# EAGLE design main (EAGLE 7.6.0)
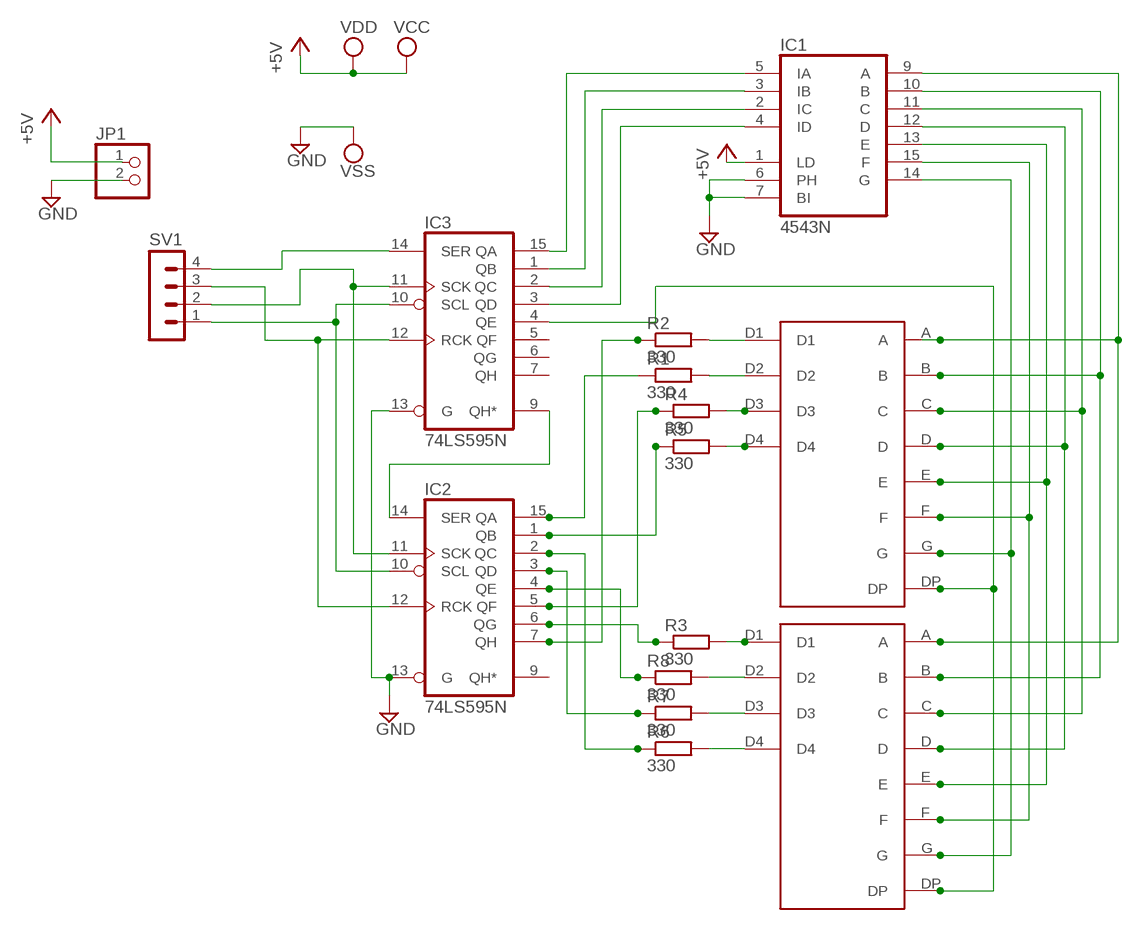
[diagram p0: schematic, sheet 1]

## Parts
IC1  4543N  [DIL16]
IC2  74LS595N  [DIL16]
IC3  74LS595N  [DIL16]
JP1  PINHD-1X2  [1X02]
R1  330  R-EU_0817/22  [P0817/22]
R2  330  R-EU_R0805  [R0805]
R3  330  R-EU_R0805  [R0805]
R4  330  R-EU_R0805  [R0805]
R5  330  R-EU_R0805  [R0805]
R6  330  R-EU_R0805  [R0805]
R7  330  R-EU_R0805  [R0805]
R8  330  R-EU_R0805  [R0805]
SV1  MA04-1  [MA04-1]
U$1  4-DIGIT_7-SEGMENT-DISPLAYTHROUGH-HOLE  [4-DIGIT_7-SEGMENT-DISPLAY]
U$2  4-DIGIT_7-SEGMENT-DISPLAYTHROUGH-HOLE  [4-DIGIT_7-SEGMENT-DISPLAY]

## Nets
+5V: IC1.1(LD) JP1.1 ; supply symbol labelled VDD, VCC
GND: IC1.6(PH) IC1.7(BI) IC2.13(G) IC3.13(G) JP1.2 ; supply symbol labelled VSS
N$1: IC1.9(A) U$1.A U$2.A
N$2: IC1.10(B) U$1.B U$2.B
N$3: IC1.11(C) U$1.C U$2.C
N$4: IC1.12(D) U$1.D U$2.D
N$5: IC1.13(E) U$1.E U$2.E
N$6: IC1.15(F) U$1.F U$2.F
N$7: IC1.14(G) U$1.G U$2.G
N$8: IC3.4(QE) U$1.DP U$2.DP
N$9: R2.2 U$1.D1
N$10: R1.2 U$1.D2
N$11: R3.2 U$2.D1
N$12: R5.2 U$1.D4
N$13: R4.2 U$1.D3
N$14: R8.2 U$2.D2
N$15: R7.2 U$2.D3
N$16: R6.2 U$2.D4
N$17: IC2.14(SER) IC3.9(QH*)
N$18: IC2.12(RCK) IC3.12(RCK) SV1.3
N$19: IC2.10(SCL) IC3.10(SCL) SV1.1
N$20: IC2.11(SCK) IC3.11(SCK) SV1.2
N$21: IC2.15(QA) R1.1
N$22: IC2.7(QH) R2.1
N$24: IC2.6(QG) R3.1
N$25: IC2.5(QF) R4.1
N$26: IC2.1(QB) R5.1
N$27: IC2.2(QC) R6.1
N$28: IC2.3(QD) R7.1
N$29: IC2.4(QE) R8.1
N$31: IC3.14(SER) SV1.4
N$33: IC1.5(IA) IC3.15(QA)
N$34: IC1.3(IB) IC3.1(QB)
N$35: IC1.2(IC) IC3.2(QC)
N$36: IC1.4(ID) IC3.3(QD)
Unconnected: IC2.9(QH*) IC3.5(QF) IC3.6(QG) IC3.7(QH)

## Power pins joined to a net without a drawn wire
+5V: IC1.16(VDD) IC2.16(VCC) IC3.16(VCC)
GND: IC1.8(VSS) IC2.8(GND) IC3.8(GND)

## Library data of the parts
IC1 = 45xx:4543: BCD to 7-segment LCD DECODER
IC2 IC3 = 74xx-us:74*595: 8-bit SHIFT REGISTER, output latch
JP1 = pinhead:PINHD-1X2: PIN HEADER
R1-R8 = resistor:R-EU_: RESISTOR, European symbol
SV1 = con-lstb:MA04-1: PIN HEADER; OC_FARNELL: unknown; OC_NEWARK: unknown
U$1 U$2 = 7_segment_lib:4-DIGIT_7-SEGMENT-DISPLAY

## Board
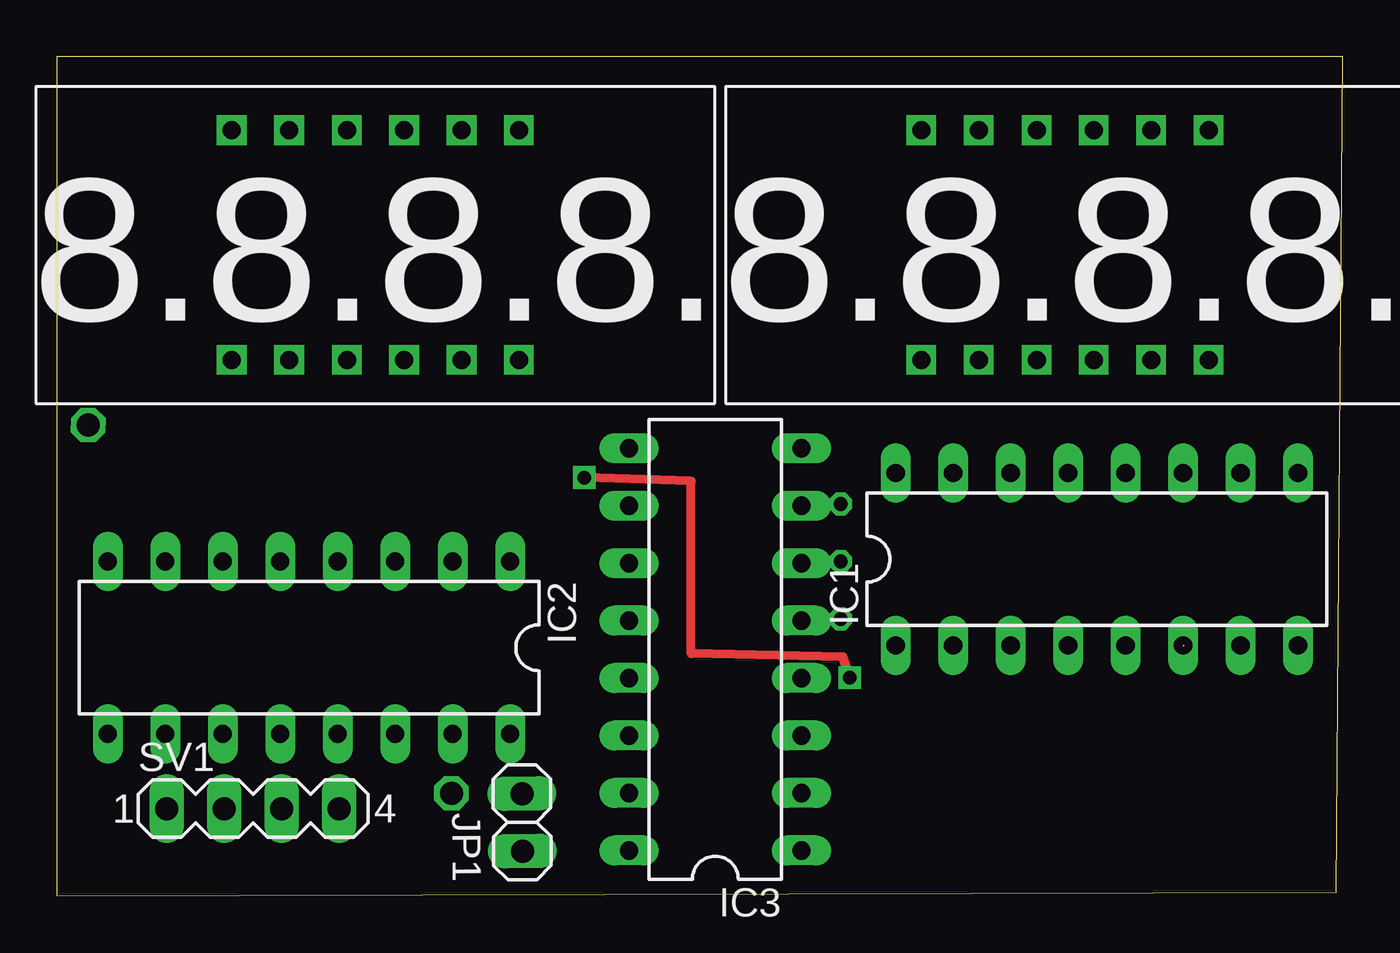
[diagram p1: board, top side]
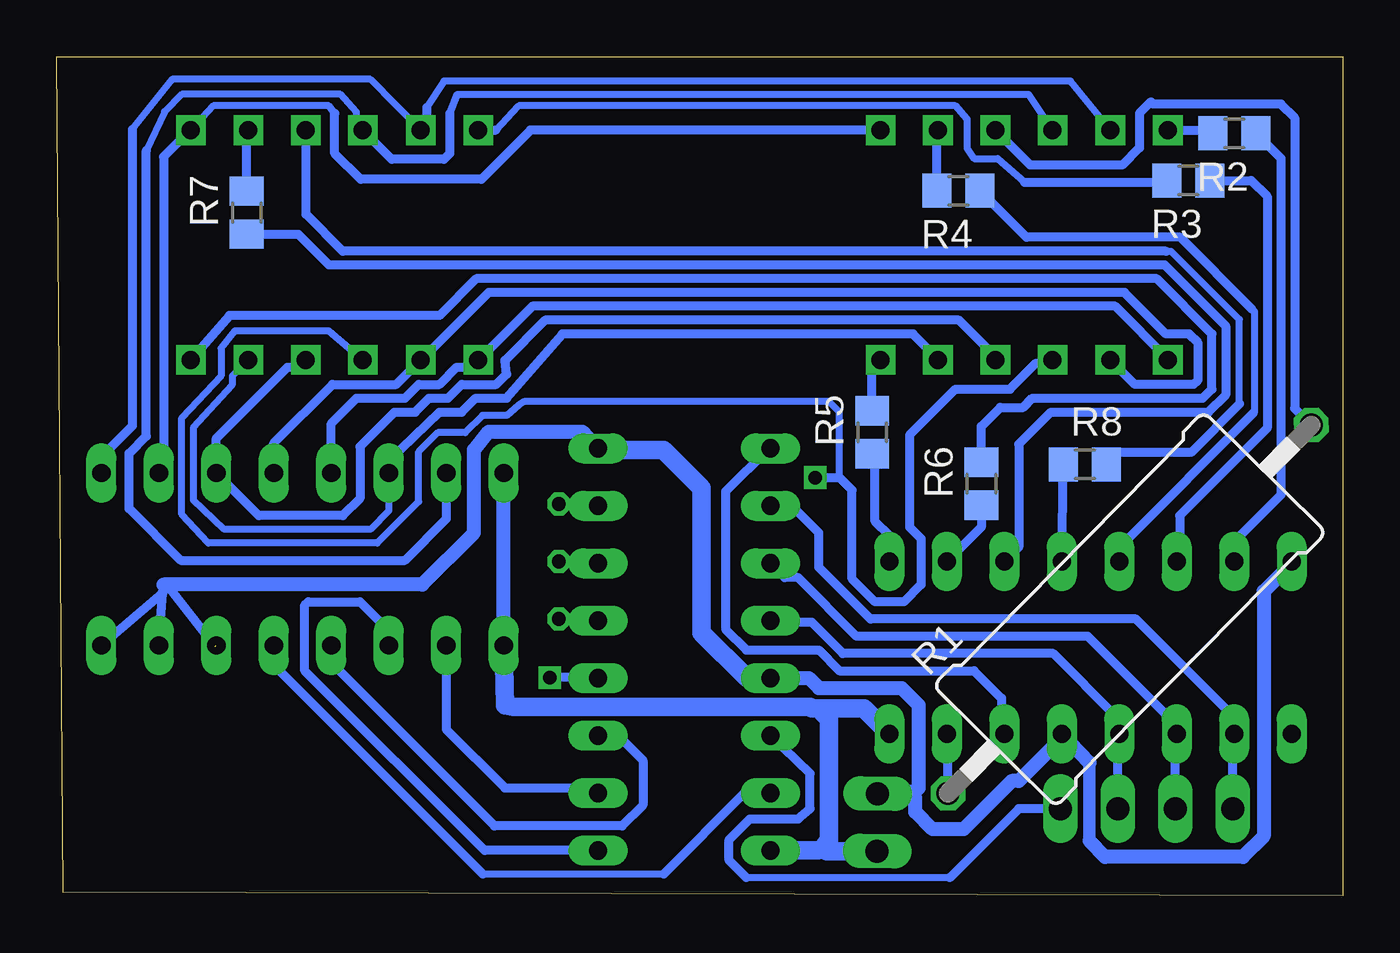
[diagram p2: board, bottom side, seen from below]

Size 56.85 x 37.1 mm. Coordinates in mm from the lower left corner, seen from the top.
Outline: 0,0 56.54,0.15 56.84,37.1 0,37.1 0,0
Copper layers (1*16): Top 0.035mm / dielectric 1.5mm / Bottom 0.035mm
Design rules "default": minimum track width 10mil, minimum drill 24mil, track to track 8mil, track to pad 8mil, pad to pad 8mil, via to via 8mil, smd to smd 8mil, copper to edge 40mil, drill to drill 8mil, minimum pad ring 10mil, minimum via ring 8mil, stop-mask expansion 4mil, vias tented up to drill 0mil, thermal gap 10mil

### Footprints (pad centres in the part's own frame; a part is rotated, then mirrored left to right if it is on the bottom)
DIL16 = drill 0.813 long: 1 -8.89,-3.81; 2 -6.35,-3.81; 3 -3.81,-3.81; 4 -1.27,-3.81; 5 1.27,-3.81; 6 3.81,-3.81; 7 6.35,-3.81; 8 8.89,-3.81; 9 8.89,3.81; 10 6.35,3.81; 11 3.81,3.81; 12 1.27,3.81; 13 -1.27,3.81; 14 -3.81,3.81; 15 -6.35,3.81; 16 -8.89,3.81
1X02 = drill 1.016 long: 1 -1.27,0; 2 1.27,0
P0817/22 = drill 1.016 octagon: 1 -11.43,0; 2 11.43,0
R0805 = smd 1.3 x 1.5: 1 -0.95,0; 2 0.95,0
MA04-1 = drill 1.016 long: 1 -3.81,0; 2 -1.27,0; 3 1.27,0; 4 3.81,0
4-DIGIT_7-SEGMENT-DISPLAY = drill 0.8 square: A 11.19,12.08; B 21.35,12.08; C 16.27,1.92; D 11.19,1.92; D1 8.65,12.08; D2 16.27,12.08; D3 18.81,12.08; D4 21.35,1.92; DP 13.75,1.92; E 8.65,1.92; F 13.75,12.08; G 18.81,1.92

### Placement (x,y rotation side)
IC1  45.97,14.88 0 top
IC2  11.15,10.97 180 top
IC3  29.11,10.9 90 top
JP1  20.57,3.25 90.4 top
R1  9.42,12.67 45.4 bottom
R2  4.8,33.71 180 bottom
R3  6.83,31.62 180 bottom
R4  16.99,31.17 180 bottom
R5  20.8,20.5 90 bottom
R6  15.98,18.21 90 bottom
R7  48.44,30.2 90 bottom
R8  11.4,19.08 0 bottom
SV1  8.69,3.86 0 top
U$1  -0.91,21.77 0 top
U$2  29.57,21.77 0 top

### Tracks (layer width: path | path; a pad name or v marks a point on that pad's centre or on a via)
+5V
  Bottom 0.61: IC1.1 IC1.16
  Bottom 0.813: 22.86,8.28 21.16,8.28 IC2.16 | IC1.1 37.03,8.43 36.65,8.36 23.55,8.36 23.47,8.28 22.86,8.28 | 25.88,2.01 IC3.16 23.19,2.01 23.16,2.03 22.86,2.03 | 22.86,8.28 23.01,8.13 22.71,7.82 22.71,2.44 22.86,2.29 22.86,2.03 | JP1.1 22.81,1.98 22.86,2.03
GND  (1 unrouted)
  Bottom 0.406: 49.84,11.02 51.97,13.77 | IC1.7 52.15,13.39 | 52.15,13.39 52.12,13.77 | IC1.8 52.15,13.39
  Bottom 0.559: 11.2,5.89 11.2,2.44
  Bottom 0.61: 52.12,13.77 51.97,13.77 40.69,13.77 38.41,16.05 38.41,19.71 37.74,20.52 33.6,20.52 IC3.8 | 26.19,9.63 IC3.13 23.6,9.63 23.16,9.19 19.51,9.19 18.75,8.43 18.75,4.77 19.05,4.47 18.9,4.32 18.9,3.71 18.14,2.95 16.76,2.95 14.63,5.08 14.33,5.08 12.42,6.98 IC2.13 | IC2.8 2.26,14.71 3.5,13.46 3.5,2.64 4.42,1.73 10.52,1.73 11.2,2.44 | IC2.13 12.29,7.16 | 11.2,5.89 IC2.13
  Bottom 0.813: 26.19,9.63 26.34,9.63 28.35,11.63 28.35,18.03 30.02,19.71 32.84,19.71 IC3.8 | JP1.2 19.1,4.52 19.05,4.47
N$1
  Bottom 0.305: 53.49,33.88 51.74,36.09 42.98,36.09 U$2.A | 40.49,34.85 39.73,36.02 12.04,36.02 U$1.A
  Bottom 0.406: 40.49,34.85 40.49,34.12 U$2.A 40.81,33.85 | 53.49,33.88 53.49,20.78 54.86,19.41 IC1.9
N$2
  Bottom 0.305: 44.55,34.59 44.81,34.92 49.91,34.92 U$2.B
  Bottom 0.406: U$1.B 35.9,33.85 38.08,31.67 43.41,31.67 44.55,32.82 44.55,34.59 | U$2.B 50.94,33.85 52.12,32.66 52.12,18.9 IC1.10
N$3
  Bottom 0.406: U$2.C 46.16,23.37 46.63,23.37 49.78,20.22 IC1.11 47.9,16.81 44.2,16.81 43.43,17.58 43.43,19.86 41.91,21.39 41,21.39 40.39,22 39.55,22 38.94,22.61 37.41,22.61 36.96,23.06 37.03,23.67 35.26,25.45 16.97,25.45 15.36,23.84 U$1.C
N$4
  Bottom 0.406: IC1.12 47.24,20.01 44.65,22.61 41.84,22.61 U$2.D 40.73,23.69 37.74,26.67 9.65,26.67 7.82,24.84 6.81,24.84 6.4,24.43 6.4,22.81 6.6,22.61 9.19,22.61 U$1.D
N$5
  Bottom 0.406: IC1.13 44.7,20.88 43.59,22 41.45,22 40.84,22.61 39.93,22.61 39.17,23.37 38.53,23.37 U$2.E 38.19,23.69 35.81,26.06 10.06,26.06 7.74,23.74 U$1.E
N$6
  Bottom 0.305: 43.59,34.12 43.59,34.65 44.3,35.43 51.31,35.43 52.07,34.67 52.88,32.94 | 39.47,34.59 39.14,35.43 13.89,35.43 U$1.F
  Bottom 0.406: 39.47,34.59 39.47,32.82 39.73,32.56 42.03,32.56 U$2.F 43.59,34.12 | U$1.F 12.84,33.87 | 52.88,32.94 52.88,20.32 53.65,19.56 53.65,17.12 51.36,14.83 41.45,14.83 39.62,16.66 IC1.15
N$7
  Bottom 0.305: U$2.G 49.07,22.99 49.07,22.61 50.8,20.7 50.8,17.5 49.43,16.2 42.98,16.2 42.16,17.02 IC1.14
  Bottom 0.406: U$1.G 17.9,23.74 19,24.84 34.49,24.84 36.96,22 38.33,22 38.94,21.39 39.93,21.39 42.16,19.23 IC1.14
N$8  (via drill 0.6)
  Top 0.406: v35.05,9.65 34.75,10.57 28.04,10.72 28.04,18.34 v23.32,18.49
  Bottom 0.305: 22.25,18.49 22.25,21.39 22.71,21.84 36.2,21.84 36.42,21.69 36.96,21.23 38.02,21.23 38.79,20.47 40.01,20.47 40.84,19.63 40.84,17.42 42.67,15.6 50.14,15.6 51.31,16.87 51.31,21.13 49.58,22.99 49.58,24.21 48.97,24.97 44.81,24.97 43.32,23.71 U$2.DP
  Bottom 0.406: 13.04,23.69 U$1.DP 12.98,23.55 13.56,23.55 14.71,22.4 17.12,22.4 19.15,20.37 19.15,16.31 18.64,15.8 18.64,13.77 19.41,13 20.68,13 21.69,14.02 21.69,17.93 22.25,18.49 v23.32,18.49 | IC3.4 32.94,9.65 v35.05,9.65
N$9
  Bottom 0.406: U$1.D1 5.89,33.85 R2.2
N$10
  Bottom 0.406: U$1.D2 13.82,32.31 9.75,32.31 8.99,33.07 8.99,34.59 8.48,35.1 8.38,35 2.74,35 2.13,34.39 2.13,21.55 R1.2
N$11
  Bottom 0.305: 37.42,33.85 36.42,34.92 17.12,34.92 16.61,34.34 16.61,33.05 16.31,32.59 15.27,32.59 14.07,31.55
  Bottom 0.406: U$2.D1 37.42,33.85 | 14.07,31.55 7.86,31.55 R3.2
N$12
  Bottom 0.406: R5.2 20.8,23.32 U$1.D4
N$13
  Bottom 0.406: R4.2 17.94,33.8 U$1.D3
N$14
  Bottom 0.305: 4.57,21.74 4.57,25.48 7.59,28.5 7.82,28.5
  Bottom 0.406: U$2.D2 45.82,33.83 45.82,30.12 44.2,28.5 7.82,28.5 | R8.2 9.92,19.61 6.71,19.61 4.57,21.74
N$15
  Bottom 0.406: R7.2 48.44,33.79 U$2.D3
N$16
  Bottom 0.406: R6.2 15.98,20.75 15.14,21.59 14.12,21.59 13.72,22 6.2,22 5.79,22.4 5.79,24.84 8.23,27.28 38.3,27.28 39.93,25.65 49.2,25.65 U$2.D4
N$17
  Bottom 0.406: IC3.9 25.38,19.79 27.28,17.88 27.28,11.79 26.36,10.87 23.16,10.87 22.25,9.96 16.31,9.96 15.09,8.74 15.09,7.29 IC2.14
N$18
  Bottom 0.406: IC3.12 25.22,12.09 23.47,12.09 22.1,10.72 12.8,10.72 10.01,7.92 10.01,7.04 IC2.12 9.96,7.09 SV1.3
N$19
  Bottom 0.406: IC3.10 25.02,16.97 24.08,16.97 23.16,16.05 23.16,14.53 20.88,12.24 9.14,12.24 4.93,8.03 4.93,7.04 IC2.10 4.88,7.09 SV1.1
N$20
  Bottom 0.406: IC3.11 24.66,14.07 24.08,14.07 21.49,11.48 11.28,11.48 7.47,7.67 7.47,7.04 IC2.11 7.42,7.09 SV1.2
N$21
  Bottom 0.406: R1.1 17.45,7.11 IC2.15
N$22
  Bottom 0.406: R2.1 2.74,32.6 2.74,17.73 4.67,15.8 4.67,14.91 IC2.7
N$24
  Bottom 0.406: R3.1 4.05,31.62 3.35,30.92 3.35,20.68 7.21,16.81 7.21,14.91 IC2.6
N$25
  Bottom 0.305: 4.04,25.96 3.91,25.83 3.91,21.39 3.96,21.34
  Bottom 0.406: R4.1 13.98,29.11 7.19,29.11 4.04,25.96 | 3.96,21.34 9.75,15.54 9.75,14.91 IC2.5
N$26
  Bottom 0.406: IC2.1 20.04,15.93 20.68,16.56 20.68,19.42 R5.1
N$27
  Bottom 0.406: R6.1 15.98,16.31 IC2.2
N$28
  Bottom 0.406: R7.1 46.17,29.25 44.81,27.89 7.87,27.89 5.18,25.2 5.18,22.15 5.94,21.39 12.9,21.39 14.33,19.96 14.33,15.42 IC2.3
N$29
  Bottom 0.406: IC2.4 R8.1
N$30  (via drill 0.6)
  Bottom 0.406: 32.74,12.24 v34.65,12.24
N$31
  Bottom 0.305: 17.37,0.81 26.36,0.81
  Bottom 0.406: SV1.4 14.33,3.86 17.37,0.81 | 26.36,0.81 27.13,1.57 27.13,2.49 26.21,3.4 24.08,3.4 23.55,3.86 23.55,5.41 IC3.14
N$32  (via drill 0.6)
  Bottom 0.406: 33.38,14.78 v34.65,14.78
N$33
  Bottom 0.305: 30.02,0.96 38,0.96
  Bottom 0.406: IC1.5 47.24,10.21 38,0.96 | IC3.15 26.44,4.55 30.02,0.96
N$34
  Bottom 0.406: IC3.1 37.92,2.01 45.87,9.96 45.87,12.85 45.72,13 43.43,13 42.52,12.09 42.52,11.43 IC1.3
N$35
  Bottom 0.406: IC1.2 39.62,7.37 37.03,4.77 33.15,4.77 IC3.2
N$36
  Bottom 0.406: IC3.3 32.03,7.09 30.94,5.99 30.94,4.01 31.85,3.1 37.49,3.1 44.65,10.26 44.65,11.02 IC1.4
N$37  (via drill 0.6)
  Bottom 0.406: 32.74,17.32 v34.65,17.32